# Altium schematic sheet Entradas.SchDoc
size A4; SheetNumber: 4; SheetTotal: 4
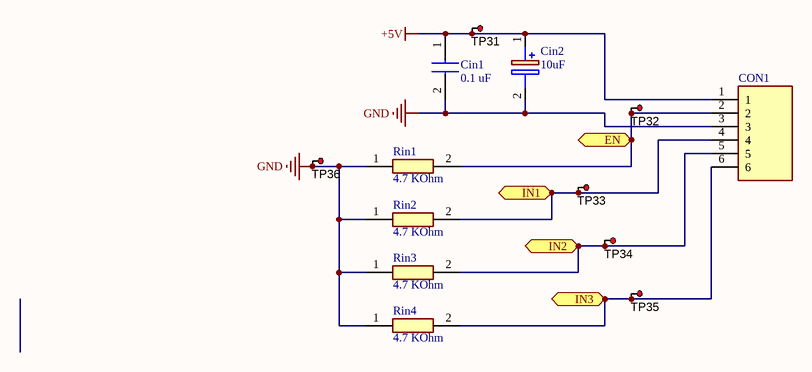
[diagram p0: Entradas.SchDoc]

## Parts
Cin1  0.1 uF  [CAPC2012X94N]
Cin2  10uF  [CAPPM3216X180N - duplicate]
CON1  2350513-6  [23505136]  (value not drawn)
Rin1  4.7 KOhm  [RESC1608X55N - duplicate]
Rin2  4.7 KOhm  [RESC1608X55N - duplicate]
Rin3  4.7 KOhm  [RESC1608X55N - duplicate]
Rin4  4.7 KOhm  [RESC1608X55N - duplicate]
TP31  5010  [Keystone5010]  (value not drawn)
TP32  5010  [Keystone5010]  (value not drawn)
TP33  5010  [Keystone5010]  (value not drawn)
TP34  5010  [Keystone5010]  (value not drawn)
TP35  5010  [Keystone5010]  (value not drawn)
TP36  5010  [Keystone5010]  (value not drawn)

## Ports
EN (bidir), IN1 (bidir), IN2 (bidir), IN3 (bidir)

## Nets
+5V: Cin1.1 Cin2.1(+) CON1.1 TP31.1
GND: Cin1.2 Cin2.2(-) CON1.3 Rin1.1 Rin2.1 Rin3.1 Rin4.1 TP36.1
EN: CON1.2 Rin1.2 TP32.1 ; port EN
IN1: CON1.4 Rin2.2 TP33.1 ; port IN1
IN2: CON1.5 Rin3.2 TP34.1 ; port IN2
IN3: CON1.6 Rin4.2 TP35.1 ; port IN3

## Library data of the parts
Cin1 = 0805YC104KAT2A: Multilayer Ceramic Capacitors MLCC - SMD/SMT 16V .1uF X7R 0805 10%; Manufacturer_Name: AVX; Manufacturer: Kyocera AVX; Capacitance: 100nF; Dissipation Factor: 12.5%; Insulation Resistance: 100GR; Datasheet Link: https://spicat.avx.com/product/mlcc/chartview/0805YC104KAT2A/DataSheet/X7R; Height: 0.94mm; Manufacturer_Part_Number: 0805YC104KAT2A; Mouser Part Number: 581-0805YC104K; Mouser Price/Stock: https://www.mouser.co.uk/ProductDetail/AVX/0805YC104KAT2A?qs=0j3vzYx9OgS3bRufCc82qg%3D%3D; Arrow Part Number: 0805YC104KAT2A; Arrow Price/Stock: https://www.arrow.com/en/products/0805yc104kat2a/avx; Supplier 1: Digi-Key; Manufacturer Part Number: 0805YC104KAT2A; RoHS: Yes; Category: Ceramic Capacitors; Stock 1: 61419; Pricing 1: 1=0.30000, 10=0.20700, 50=0.12420, 100=0.10490, 500=0.07176, 1000=0.06348 (USD); Mount: Surface Mount; Case/Package: 0805; Number of Pins: 2; Case Code (Metric): 2012; Case Code (Imperial): 0805; Min Operating Temperature: -55°C; Max Operating Temperature: 125°C; Tolerance: 10%; Dielectric: X7R; Packaging: Tape and Reel; Voltage Rating: 16V; Package Quantity: 1; Termination: SMD/SMT; Voltage Rating (DC): 16V; Series: -; Construction: Flat; Length: 2.01mm; Width: 0.049inch; Depth: 1.25mm; Thickness: 0.037inch; Radiation Hardening: No; REACH SVHC: No SVHC; Lead Free: Lead Free; RoHS Compliant: Yes; ComponentLink1URL: https://datasheet.ciiva.com/206/cx7r-206011.pdf?src-supplier=Digi-Key; ComponentLink1Description: https://datasheet.ciiva.com/206/cx7r-206011.pdf?src-supplier=Digi-Key; ComponentLink2URL: https://datasheet.ciiva.com/5418/cx7r-5418479.pdf?src-supplier=Mouser; ComponentLink2Description: https://datasheet.ciiva.com/5418/cx7r-5418479.pdf?src-supplier=Mouser; ComponentLink3URL: https://datasheet.ciiva.com/2988/cx7r-2988050.pdf?src-supplier=Avnet; ComponentLink3Description: https://datasheet.ciiva.com/2988/cx7r-2988050.pdf?src-supplier=Avnet; ComponentLink4URL: https://datasheet.ciiva.com/14906/cx7r-14906278.pdf?src-supplier=Digi-Key; ComponentLink4Description: https://datasheet.ciiva.com/14906/cx7r-14906278.pdf?src-supplier=Digi-Key; ComponentLink5URL: https://datasheet.ciiva.com/15212/getdatasheetpartid-150472-15212621.pdf?src-supplier=Verical; ComponentLink5Description: https://datasheet.ciiva.com/15212/getdatasheetpartid-150472-15212621.pdf?src-supplier=Verical; ComponentLink6URL: https://datasheet.ciiva.com/28613/1679506-28613143.pdf?src-supplier=Element14; ComponentLink6Description: https://datasheet.ciiva.com/28613/1679506-28613143.pdf?src-supplier=Element14; ComponentLink7URL: https://datasheet.ciiva.com/16623/cx7r-16623414.pdf?src-supplier=Avnet+Europe; ComponentLink7Description: https://datasheet.ciiva.com/16623/cx7r-16623414.pdf?src-supplier=Avnet+Europe; Supplier Part Number 1: 478-7961-1-ND
Cin2 = T494A106M020AT: Cap Tant Solid 10uF 20V A CASE 20% (3.2 X 1.6 X 1.6mm) SMD 3216-18 3 Ohm 125C T/R; Manufacturer_Name: Kemet; ESR (Equivalent Series Resistance): 3R; Ripple Current: 158mA; Leakage Current: 2uA; Polarity: Polar; Dissipation Factor: 10%; Life (Hours): 2000Hour; Datasheet Link: https://componentsearchengine.com/Datasheets/2/T494A106M020AT.pdf; Height: 1.8mm; Manufacturer_Part_Number: T494A106M020AT; Supplier 1: Digi-Key; Manufacturer: KEMET; Manufacturer Part Number: T494A106M020AT; RoHS: Yes; Category: Tantalum Capacitors; Stock 1: 10000; Pricing 1: 1=0.85000, 10=0.64900, 50=0.53900, 100=0.46420, 500=0.35936, 1000=0.30946 (USD); Mount: Surface Mount; Case/Package: 1206; Case Code (Imperial): 1206; Case Code (Metric): 3216; Min Operating Temperature: -55°C; Max Operating Temperature: 125°C; Packaging: Tape and Reel; Capacitance: 10uF; Tolerance: 20%; Voltage Rating (DC): 20V; Voltage Rating: 20V; Package Quantity: 1; Termination: SMD/SMT; Features: General Purpose; Series: T494; Construction: Flat; Length: 3.2mm; Width: 1.6mm; Height - Seated (Max): 0.071inch; Depth: 1.6mm; Radiation Hardening: No; REACH SVHC: No SVHC; RoHS Compliant: Yes; ComponentLink1URL: https://datasheet.ciiva.com/22691/1778347-22691442.pdf?src-supplier=Element14; ComponentLink1Description: https://datasheet.ciiva.com/22691/1778347-22691442.pdf?src-supplier=Element14; ComponentLink2URL: https://datasheet.ciiva.com/258/kem-t2008-t494-258774.pdf?src-supplier=Digi-Key; ComponentLink2Description: https://datasheet.ciiva.com/258/kem-t2008-t494-258774.pdf?src-supplier=Digi-Key; ComponentLink3URL: https://datasheet.ciiva.com/258/kem-t2008-t494-258775.pdf?src-supplier=Digi-Key; ComponentLink3Description: https://datasheet.ciiva.com/258/kem-t2008-t494-258775.pdf?src-supplier=Digi-Key; ComponentLink4URL: https://datasheet.ciiva.com/258/kem-t2008-t494-258776.pdf?src-supplier=Digi-Key; ComponentLink4Description: https://datasheet.ciiva.com/258/kem-t2008-t494-258776.pdf?src-supplier=Digi-Key; Supplier Part Number 1: 399-5157-1-ND
CON1 = 2350513-6: Connector; Manufacturer_Name: TE Connectivity; Datasheet Link: https://componentsearchengine.com/Datasheets/1/2350513-6.pdf; Height: 8.6mm; Manufacturer_Part_Number: 2350513-6; Supplier 1: Digi-Key; Manufacturer: TE Connectivity; Manufacturer Part Number: 2350513-6; RoHS: Yes; Stock 1: 2983; Pricing 1: 1=1.16000, 10=0.81200, 25=0.75720, 50=0.68740, 100=0.68430, 250=0.57788, 500=0.54748, 1000=0.48664, 5000=0.39540 (USD); Supplier Part Number 1: A145376-ND
Rin1-Rin4 = ESR03EZPJ472: Manufacturer_Name: ROHM Semiconductor; Manufacturer: Rohm; Resistance: 4.7kR; Tolerance: 5%; Temperature Coefficient: 200ppm/°C; Max Power Dissipation: 250mW; Datasheet Link: http://www.rohm.com/web/global/datasheet/ESR01MZPF/esr-e; Height: 0.55mm; Manufacturer_Part_Number: ESR03EZPJ472; Supplier 1: Digi-Key; Manufacturer Part Number: ESR03EZPJ472; RoHS: Yes; Category: Chip SMD Resistors; Stock 1: 85174; Pricing 1: 1=0.10000, 10=0.08200, 100=0.03160, 1000=0.01392, 2500=0.01202 (USD); Case/Package: 0603; Case Code (Imperial): 0603; Min Operating Temperature: -55°C; Max Operating Temperature: 155°C; Package Quantity: 5000; Packaging: Tape and Reel; Resistor Type: Thick Film; Number of Terminations: 2; Features: Automotive AEC-Q200; Series: ESR; Length: 0.063inch; Width: 0.031inch; RoHS Compliant: Yes; ComponentLink1URL: https://datasheet.ciiva.com/2468/esr-2468934.pdf?src-supplier=Digi-Key; ComponentLink1Description: https://datasheet.ciiva.com/2468/esr-2468934.pdf?src-supplier=Digi-Key; Supplier Part Number 1: RHM4.7KDCT-ND
TP31-TP36 = 5010: Test Point, Multipurpose, Red, TH; Manufacturer: Keystone; CompType: Test Point Loop; ContactFinish: Silver; SymbolVersion: 2008-04-04; PartNumber: 5010; PackageReference: Red Multipurpose Testpoint; RoHS: Y; MountType: TH; ComponentLink1Description: Datasheet URL; ComponentLink1URL: http://www.keyelco.com/userAssets/file/M60-2p60.pdf; Color: Red; Publisher: Texas Instruments; LatestRevisionDate: 2016-02-11; Supplier 1: Digi-Key; Supplier Part Number 1: 36-5010-ND; Supplier 2: Mouser; Supplier Part Number 2: 534-5010